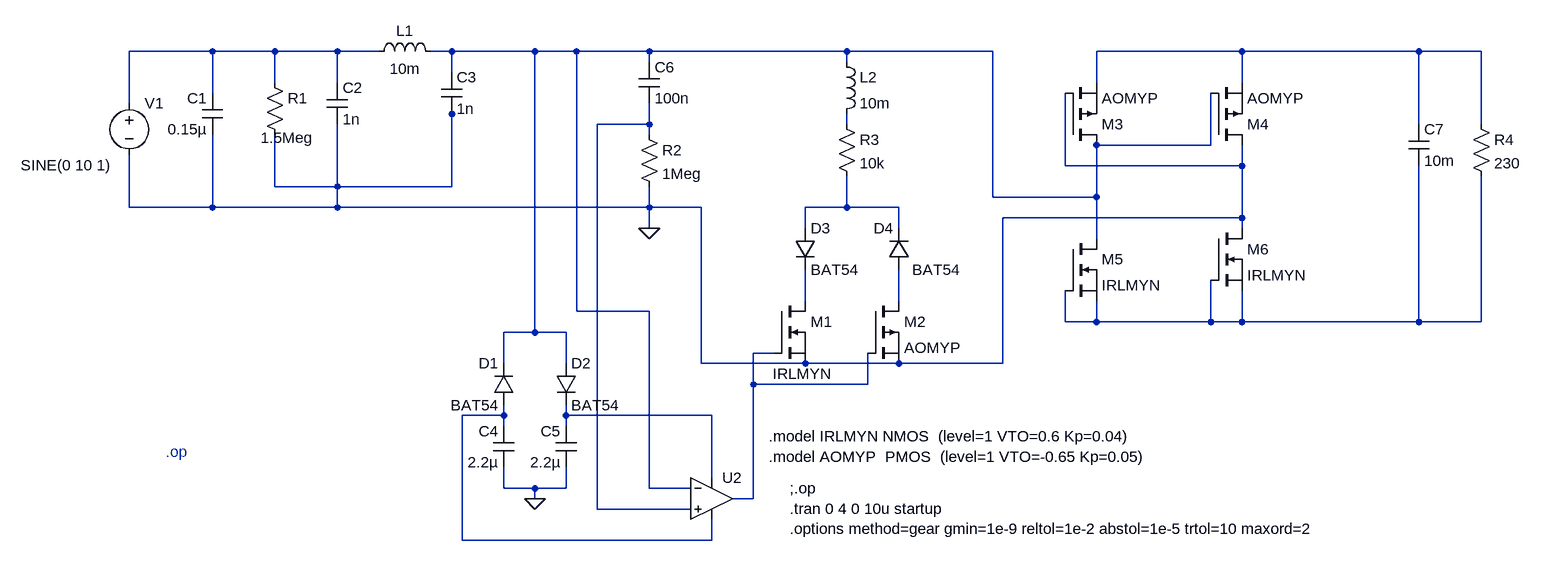
[diagram p0: schematic FINAL_CIRCUIT.asc]
FINAL_CIRCUIT.asc, the LTspice schematic file:
Version 4.1
SHEET 1 1428 680
WIRE -592 -160 -720 -160
WIRE -496 -160 -592 -160
WIRE -400 -160 -496 -160
WIRE -336 -160 -400 -160
WIRE -224 -160 -256 -160
WIRE -96 -160 -224 -160
WIRE -32 -160 -96 -160
WIRE 80 -160 -32 -160
WIRE 384 -160 80 -160
WIRE 608 -160 384 -160
WIRE 992 -160 768 -160
WIRE 1264 -160 992 -160
WIRE 1360 -160 1264 -160
WIRE 80 -144 80 -160
WIRE 384 -144 384 -160
WIRE -224 -128 -224 -160
WIRE -496 -112 -496 -160
WIRE -400 -112 -400 -160
WIRE 768 -112 768 -160
WIRE 992 -112 992 -160
WIRE -592 -96 -592 -160
WIRE -720 -80 -720 -160
WIRE -224 -64 -224 -80
WIRE 80 -48 80 -80
WIRE 80 -48 0 -48
WIRE 384 -48 384 -64
WIRE 1264 -48 1264 -160
WIRE 1360 -48 1360 -160
WIRE 80 -32 80 -48
WIRE 944 -16 944 -96
WIRE 944 -16 768 -16
WIRE 720 16 720 -96
WIRE 992 16 992 -16
WIRE 992 16 720 16
WIRE -496 48 -496 -32
WIRE -400 48 -400 -48
WIRE -400 48 -496 48
WIRE -224 48 -224 -64
WIRE -224 48 -400 48
WIRE 608 64 608 -160
WIRE 768 64 768 -16
WIRE 768 64 608 64
WIRE -720 80 -720 0
WIRE -592 80 -592 -32
WIRE -592 80 -720 80
WIRE -400 80 -400 48
WIRE -400 80 -592 80
WIRE 80 80 80 48
WIRE 80 80 -400 80
WIRE 160 80 80 80
WIRE 384 80 384 32
WIRE 384 80 320 80
WIRE 464 80 384 80
WIRE 992 96 992 16
WIRE 992 96 624 96
WIRE 80 112 80 80
WIRE 320 112 320 80
WIRE 464 112 464 80
WIRE 992 112 992 96
WIRE 768 128 768 64
WIRE 320 224 320 176
WIRE 464 224 464 176
WIRE -32 240 -32 -160
WIRE 80 240 -32 240
WIRE 720 256 720 208
WIRE 768 256 768 224
WIRE 768 256 720 256
WIRE 944 256 944 192
WIRE 944 256 768 256
WIRE 992 256 992 208
WIRE 992 256 944 256
WIRE 1264 256 1264 16
WIRE 1264 256 992 256
WIRE 1360 256 1360 32
WIRE 1360 256 1264 256
WIRE -96 272 -96 -160
WIRE -96 272 -144 272
WIRE -48 272 -96 272
WIRE 272 304 240 304
WIRE -144 320 -144 272
WIRE -48 320 -48 272
WIRE 160 320 160 80
WIRE 320 320 160 320
WIRE 464 320 320 320
WIRE 624 320 624 96
WIRE 624 320 464 320
WIRE 240 352 240 304
WIRE 416 352 416 304
WIRE 416 352 240 352
WIRE -144 400 -144 384
WIRE -144 400 -208 400
WIRE -48 400 -48 384
WIRE 176 400 -48 400
WIRE -144 416 -144 400
WIRE -48 416 -48 400
WIRE 176 496 176 400
WIRE -144 512 -144 480
WIRE -96 512 -144 512
WIRE -48 512 -48 480
WIRE -48 512 -96 512
WIRE 80 512 80 240
WIRE 144 512 80 512
WIRE -96 528 -96 512
WIRE 240 528 240 352
WIRE 240 528 208 528
WIRE 0 544 0 -48
WIRE 144 544 0 544
WIRE -208 592 -208 400
WIRE 176 592 176 560
WIRE 176 592 -208 592
FLAG 80 112 0
FLAG -96 528 0
SYMBOL voltage -720 -96 R0
WINDOW 123 0 0 Left 0
WINDOW 39 0 0 Left 0
WINDOW 3 -167 111 Left 2
SYMATTR Value SINE(0 10 1)
SYMATTR InstName V1
SYMBOL res -512 -128 R0
WINDOW 3 -6 101 Left 2
SYMATTR Value 1.5Meg
SYMATTR InstName R1
SYMBOL cap -576 -32 R180
WINDOW 0 24 56 Left 2
WINDOW 3 24 8 Left 2
SYMATTR InstName C1
SYMATTR Value 0.15µ
SYMBOL cap -416 -112 R0
SYMATTR InstName C2
SYMATTR Value 1n
SYMBOL cap -240 -128 R0
SYMATTR InstName C3
SYMATTR Value 1n
SYMBOL ind -352 -144 R270
WINDOW 0 32 56 VTop 2
WINDOW 3 5 56 VBottom 2
SYMATTR InstName L1
SYMATTR Value 10m
SYMBOL cap -128 480 R180
WINDOW 0 24 56 Left 2
WINDOW 3 24 8 Left 2
SYMATTR InstName C4
SYMATTR Value 2.2µ
SYMBOL cap -32 480 R180
WINDOW 0 24 56 Left 2
WINDOW 3 24 8 Left 2
SYMATTR InstName C5
SYMATTR Value 2.2µ
SYMBOL cap 64 -144 R0
SYMATTR InstName C6
SYMATTR Value 100n
SYMBOL res 64 -48 R0
SYMATTR InstName R2
SYMATTR Value 1Meg
SYMBOL ind 368 -160 R0
SYMATTR InstName L2
SYMATTR Value 10m
SYMBOL res 368 -64 R0
SYMATTR InstName R3
SYMATTR Value 10k
SYMBOL nmos 272 224 R0
WINDOW 3 -2 112 Left 2
SYMATTR Value IRLMYN
SYMATTR InstName M1
SYMBOL pmos 416 224 R0
SYMATTR InstName M2
SYMATTR Value AOMYP
SYMBOL pmos 720 -16 M180
SYMATTR InstName M3
SYMATTR Value AOMYP
SYMBOL pmos 944 -16 M180
SYMATTR InstName M4
SYMATTR Value AOMYP
SYMBOL nmos 720 128 R0
SYMATTR InstName M5
SYMATTR Value IRLMYN
SYMBOL nmos 944 112 R0
SYMATTR InstName M6
SYMATTR Value IRLMYN
SYMBOL cap 1248 -48 R0
SYMATTR InstName C7
SYMATTR Value 10m
SYMBOL res 1344 -64 R0
SYMATTR InstName R4
SYMATTR Value 230
SYMBOL diode -128 384 R180
WINDOW 0 24 64 Left 2
WINDOW 3 24 0 Left 2
SYMATTR InstName D1
SYMATTR Value BAT54
SYMBOL diode -64 320 R0
SYMATTR InstName D2
SYMATTR Value BAT54
SYMBOL diode 304 112 R0
SYMATTR InstName D3
SYMATTR Value BAT54
SYMBOL diode 480 176 R180
WINDOW 0 24 64 Left 2
WINDOW 3 -78 0 Left 2
SYMATTR InstName D4
SYMATTR Value BAT54
SYMBOL OpAmps\\UniversalOpAmp2 176 528 R0
SYMATTR InstName U2
TEXT 264 432 Left 2 !.model IRLMYN NMOS  (level=1 VTO=0.6 Kp=0.04)\n.model AOMYP  PMOS  (level=1 VTO=-0.65 Kp=0.05)
TEXT 296 512 Left 2 !;.op\n.tran 0 4 0 10u startup\n.options method=gear gmin=1e-9 reltol=1e-2 abstol=1e-5 trtol=10 maxord=2
TEXT -664 456 Left 2 ;.op

The netlist it stands for:
* FINAL_CIRCUIT.asc
V1 N001 0 SINE(0 10 1)
R1 N001 0 1.5Meg
C1 0 N001 0.15µ
C2 N001 0 1n
C3 N002 0 1n
L1 N001 N002 10m
C4 0 N011 2.2µ
C5 0 N012 2.2µ
C6 N002 N004 100n
R2 N004 0 1Meg
L2 N002 N005 10m
R3 N005 N006 10k
M1 N007 N010 0 0 IRLMYN
M2 N008 N010 0 0 AOMYP
M3 N002 0 N003 N003 AOMYP
M4 0 N002 N003 N003 AOMYP
M5 N002 N009 N009 N009 IRLMYN
M6 0 N009 N009 N009 IRLMYN
C7 N003 N009 10m
R4 N003 N009 230
D1 N011 N002 BAT54
D2 N002 N012 BAT54
D3 N006 N007 BAT54
D4 N008 N006 BAT54
X§U2 N004 N002 N012 N011 N010 level2 Avol=1Meg GBW=10Meg Slew=10Meg Ilimit=25m Rail=0 Vos=0 En=0 Enk=0 In=0 Ink=0 Rin=500Meg  ; pins In+ In- V+ V- OUT
.model D D
.lib standard.dio
.model NMOS NMOS
.model PMOS PMOS
.lib standard.mos
.model IRLMYN NMOS  (level=1 VTO=0.6 Kp=0.04)
.model AOMYP  PMOS  (level=1 VTO=-0.65 Kp=0.05)
;.op
.tran 0 4 0 10u startup
.options method=gear gmin=1e-9 reltol=1e-2 abstol=1e-5 trtol=10 maxord=2
* .op
.lib UniversalOpAmp2.lib
.backanno
.end